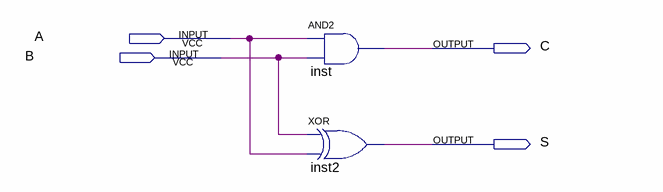
[diagram p0: schematic sheet]
// Quartus schematic ex06_1.bdf as structural Verilog: 2 symbols, 4 pins
module ex06_1 (
  input  A,
  input  B,
  output C,
  output S
);

  and inst (C, A, B);
  xor inst2 (S, B, A);
endmodule
